# EAGLE schematic AFM_Power_board__ALL_SMD (EAGLE 9.6.2)
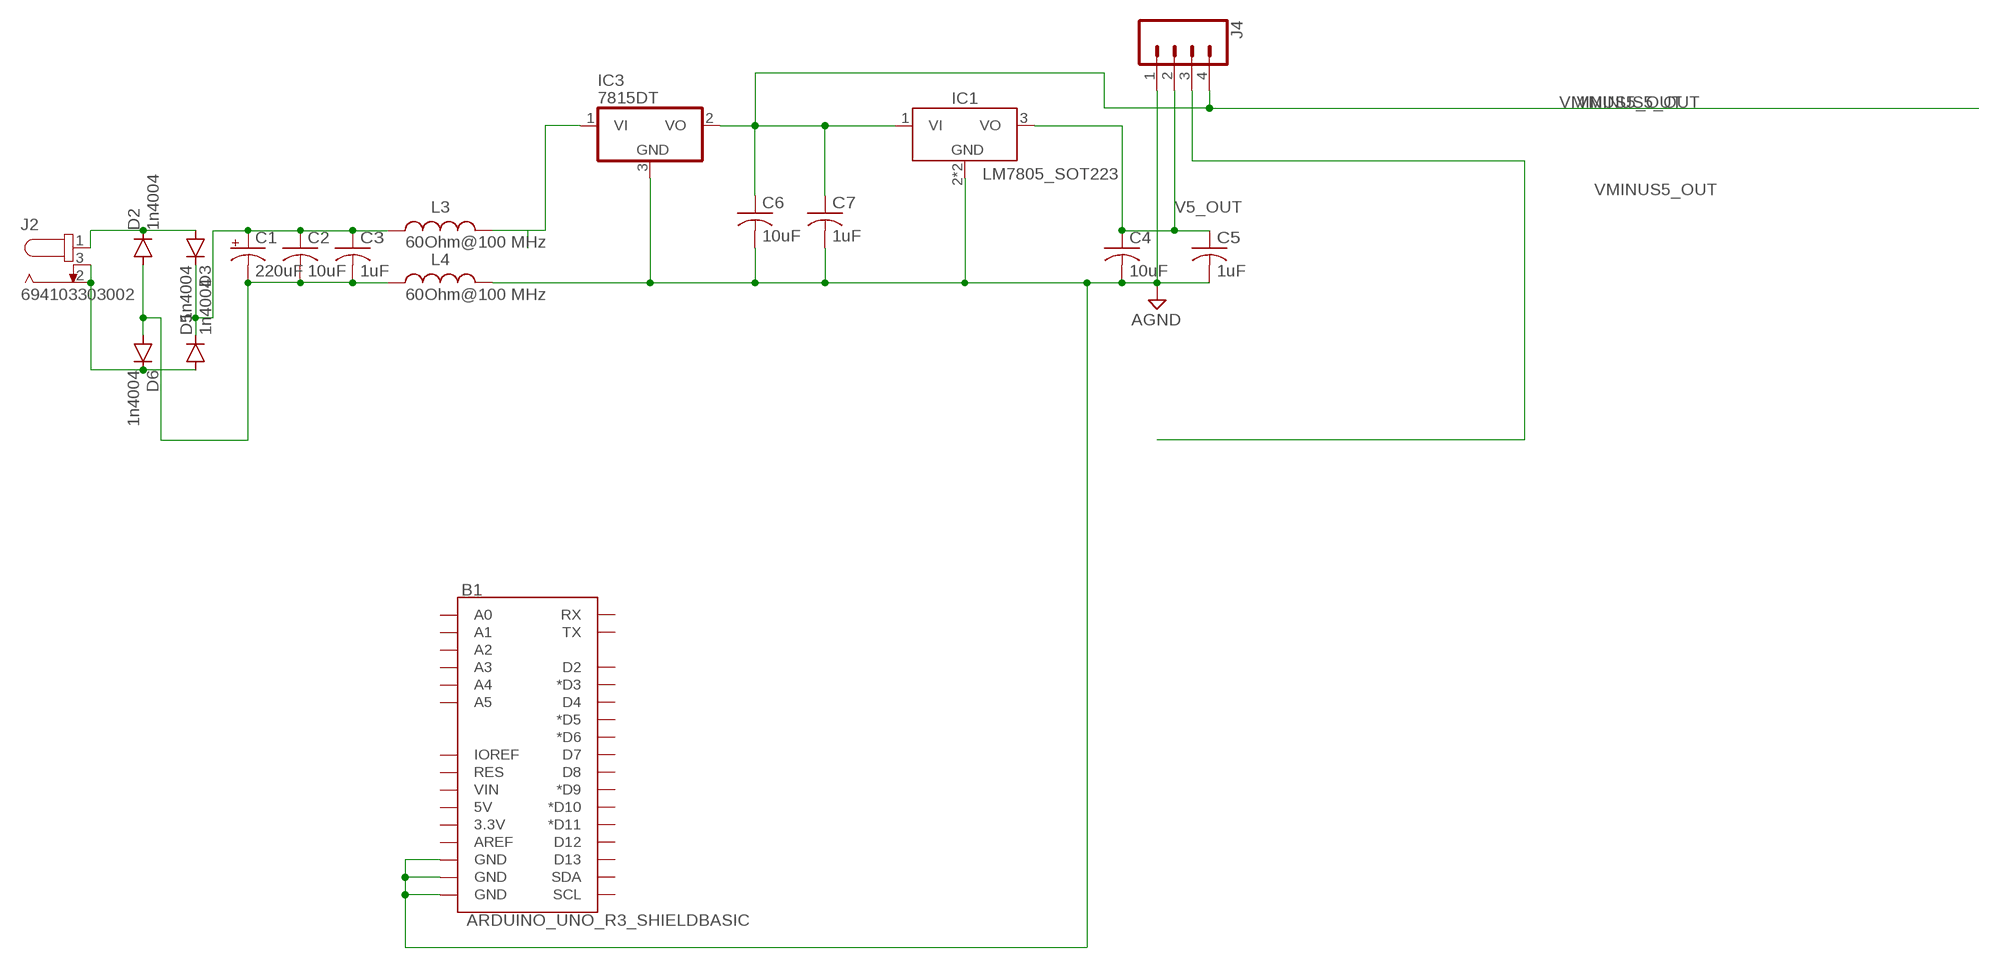
[diagram p0: schematic, sheet 1]

## Parts
B1  ARDUINO_UNO_R3_SHIELDBASIC  [UNO_R3_SHIELD]
C1  220uF  CAPACITOR-PE5-8.5  [E5-8,5]
C2  10uF  C-US050-024X044  [C050-024X044]
C3  1uF  C-US050-024X044  [C050-024X044]
C4  10uF  C-US050-024X044  [C050-024X044]
C5  1uF  C-US050-024X044  [C050-024X044]
C6  10uF  C-US050-024X044  [C050-024X044]
C7  1uF  C-US050-024X044  [C050-024X044]
D2  1n4004  DIODE-SOD123  [SOD123]
D3  1n4004  DIODE-SOD123  [SOD123]
D5  1n4004  DIODE-SOD123  [SOD123]
D6  1n4004  DIODE-SOD123  [SOD123]
IC1  LM7805_SOT223  [SOT230P700X170-4]
IC3  7815DT  [TO252]
J2  694103303002  [694103303002]
J4  CONN_04LONGPADS  [1X04_LONGPADS]
L3  60Ohm@100 MHz  WE-CBF_0603_74279267_WB_HS  [WE-CBF_0603_W2.2]
L4  60Ohm@100 MHz  WE-CBF_0603_74279267_WB_HS  [WE-CBF_0603_W2.2]

## Nets
AGND: B1.GND@0(GND) B1.GND@1(GND) B1.GND@2(GND) C4.2 C5.2 C6.2 C7.2 IC1.2(GND) IC1.4(GND) IC3.3(GND) J4.1 L4.2
GROUND: C1.- C2.2 C3.2 D2.A D6.A L4.1
N$1: D5.A D6.C J2.2 J2.3
N$5: IC3.1(VI) L3.2
N$11: C1.+ C2.1 C3.1 D3.C D5.C L3.1
POWERP: D2.C D3.A J2.1
V5_OUT: C4.1 C5.1 IC1.3(VO) J4.2
V15+: C6.1 C7.1 IC1.1(VI) IC3.2(VO) J4.4
VMINUS5_OUT: J4.3
Unconnected: B1.3.3V B1.5V B1.A0 B1.A1 B1.A2 B1.A3 B1.A4 B1.A5 B1.AREF B1.D2 B1.D3(*D3) B1.D4 B1.D5(*D5) B1.D6(*D6) B1.D7 B1.D8 B1.D9(*D9) B1.D10(*D10) B1.D11(*D11) B1.D12 B1.D13 B1.IOREF B1.RES B1.RX B1.SCL B1.SDA B1.TX B1.VIN

## Library data of the parts
B1 = SparkFun-Boards:ARDUINO_UNO_R3_SHIELD: Arduino R3 Shield Footprint Shield form compatible with the Arduino Uno R3. SparkFun Products: MG2639 Cellular Shield <https://www.sparkfun.com/products/13120> MIDI Shield <https://www.sparkfun.com/products/12898> R3 Stackable Headers Kit <https://www.sparkfun.com/products/11417>
C1 = BeagleBone_Blue_R3:CAPACITOR-P: POLARIZED CAPACITOR, American symbol
C2-C7 = BeagleBone_Black_Wireless:C-US: CAPACITOR, American symbol
D2 D3 D5 D6 = diode:DIODE-: DIODE
IC1 = IC_Power-Management:LM7805: 5V Voltage Regulator Reference Datasheet <https://www.ti.com/lit/ds/symlink/lm340.pdf>; CATEGORY: IC_Logic; DESCRIPTION: 5V Voltage Regulator; MANUFACTURER: Generic; MPN: Generic; SERIES: LM7805; SUB-CATEGORY: Voltage Regulator; TYPE: 5V
IC3 = adafruit:78*: Positive VOLTAGE REGULATOR Added bigger pads to the TO-92 package
J2 = DC Power Jacks:694103303002: CONN PWR JACK 1.05X3.5MM SOLDER Manufacturer's datasheet <https://katalog.we-online.de/em/datasheet/6941xx303002.pdf>; CREATED_BY: PCBLayout.com; DIGIKEY_PART_NUMBER: 732-5925-ND; MANUFACTURER: Wurth Electronics Inc.; MPN: 694103303002
J4 = SparkFun-Connectors:CONN_04: Multi connection point. Often used as Generic Header-pin footprint for 0.1 inch spaced/style header connections On any of the 0.1 inch spaced packages, you can populate with these: Break Away Headers - Straight <https://www.sparkfun.com/products/116> (PRT-00116) Break Away Male Headers - Right Angle <https://www.sparkfun.com/products/553> (PRT-00553) Female Headers <https://www.sparkfun.com/products/115> (PRT-00115) Break Away Headers - Machine Pin <https://www.sparkfun.com/products/117> (PRT-00117) Break Away Female Headers - Swiss Machine Pin <https://www.sparkfun.com/products/743> (PRT-00743) For SCREWTERMINALS and SPRING TERMINALS visit here: Screw Terimnals on SparkFun.com <https://www.sparkfun.com/search/results?term=Screw+Terminals> (5mm/3.5mm/2.54mm spacing) This device is also useful as a general connection point to wire up your design to another part of your project. Our various solder wires solder well into these plated through hole pads. Hook-Up Wire - Assortment (Stranded, 22 AWG) <https://www.sparkfun.com/products/11375> (PRT-11375) Hook-Up Wire - Assortment (Solid Core, 22 AWG) <https://www.sparkfun.com/products/11367> (PRT-11367) View the entire wire category on our website here <https://www.sparkfun.com/categories/141> Special notes: Molex polarized connector foot print use with SKU : PRT-08231 with associated crimp pins and housings. 1MM SMD Version SKU: PRT-10208; PROD_ID: CONN-09696
L3 L4 = Wurth_EMC Components_WE-CBF:WE-CBF_0603: WE-CBF SMD EMI Suppression Ferrite Bead Characteristics Reliable Ni-Sn electrodes High rated current up to 6 A Operating temperature: –55 ºC to +125 ºC Applications Perfect as data lined filter and for uncoupling of distribution voltage Package name and Variant abbreviation: Package: Wide Band /High Speed: W=Width= 2.2 High Current: W=Width= 2.6 Variant abbreviation: WB = Wide Band HS=High Speed HC=High Current <https://www.we-online.com/catalog/media/o14753v209%20Family_WE-CBF.jpg> Details see: www.we-online.com/katalog/WE-CBF <www.we-online.com/catalog/WE-CBF/?utm_source=eagle_model&utm_medium=description_link&utm_campaign=eisos_eagle> Updated by Ella Wu 2022-11-02 2022(C) Wurth Elektronik; DATASHEET-URL: https://www.we-online.com/redexpert/spec/74279267?ae; IR2: 2000mA; MOUNT: SMT; PART-NUMBER: 74279267; RDC-MAX: 0.3Ohm; TYPE: High Speed; Z-MAX: 110Ohm@650 MHz